# EAGLE design mini-keyboard (EAGLE 7.7.0)
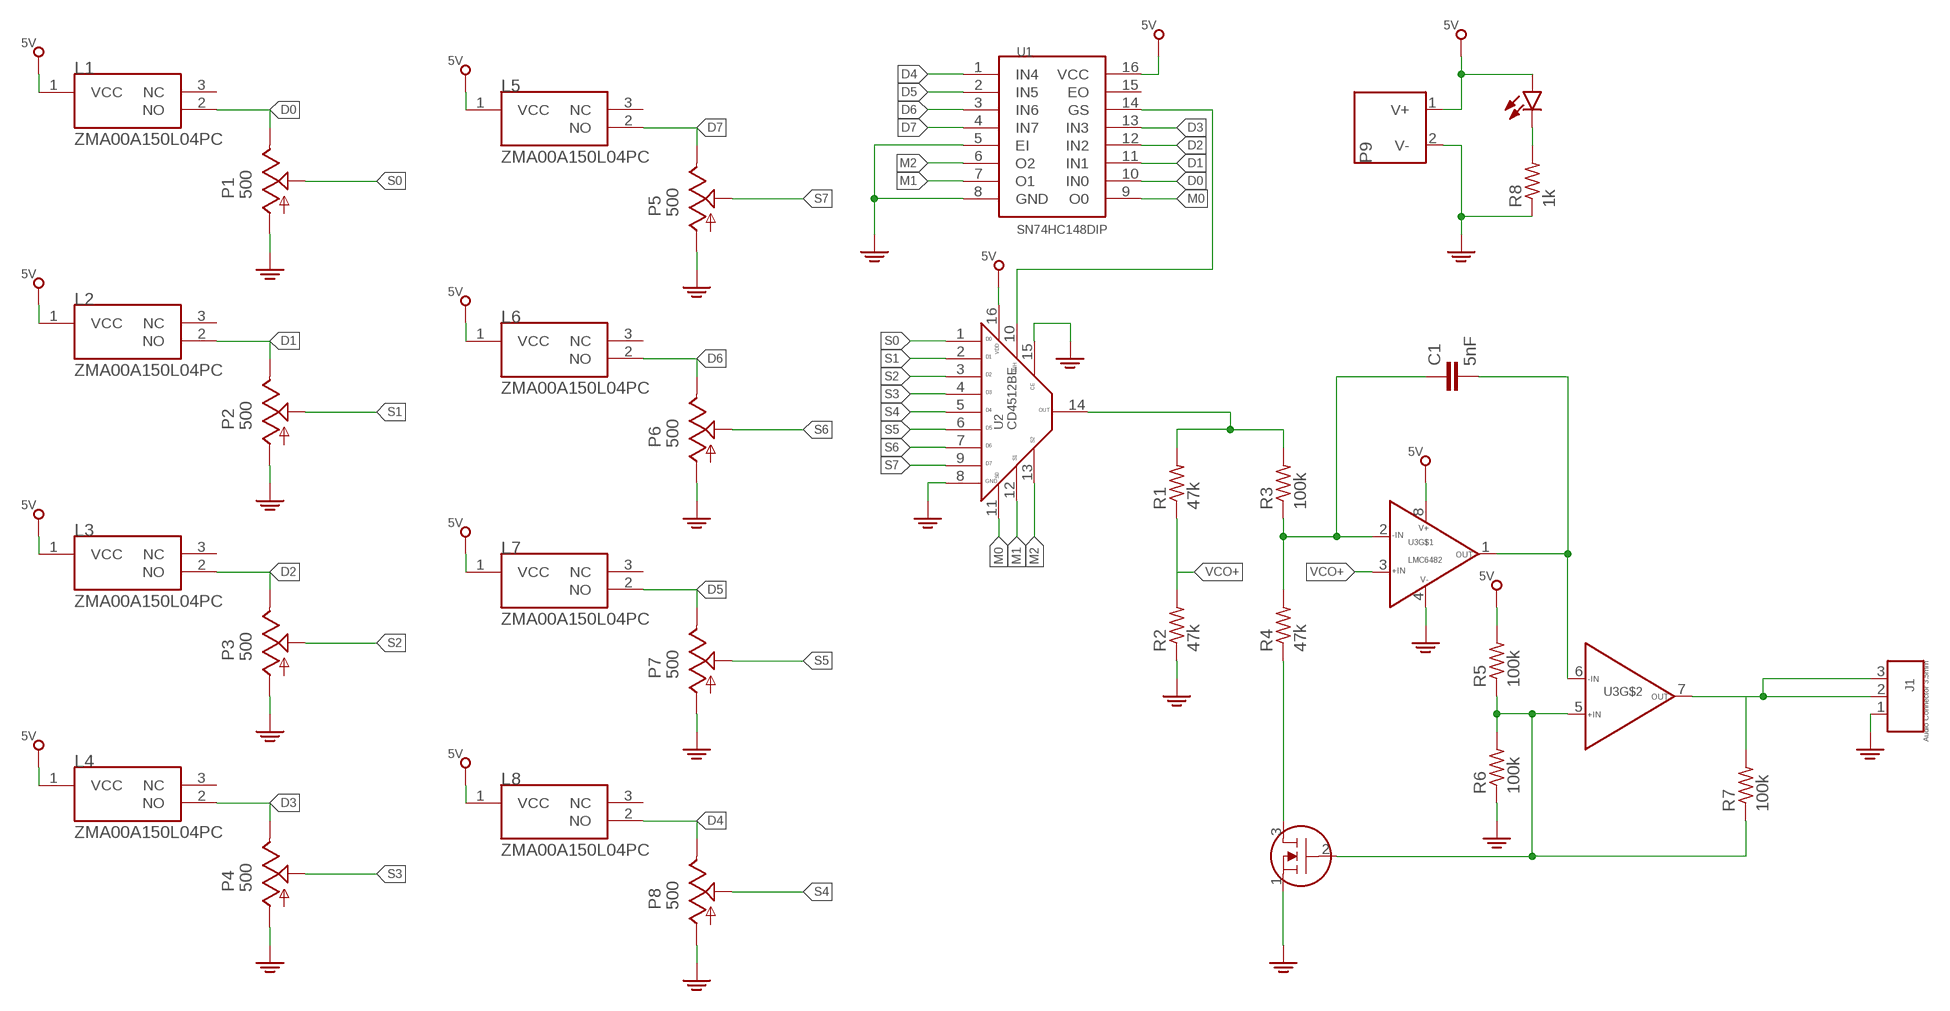
[diagram p0: schematic, sheet 1]

## Parts
C1  5nF  C0603  [0603]
J1  SJ-3523-SMT  [SJ-352X-SMT]
L1  ZMA00A150L04PC  [ZMA-LIMSWITCH]
L2  ZMA00A150L04PC  [ZMA-LIMSWITCH]
L3  ZMA00A150L04PC  [ZMA-LIMSWITCH]
L4  ZMA00A150L04PC  [ZMA-LIMSWITCH]
L5  ZMA00A150L04PC  [ZMA-LIMSWITCH]
L6  ZMA00A150L04PC  [ZMA-LIMSWITCH]
L7  ZMA00A150L04PC  [ZMA-LIMSWITCH]
L8  ZMA00A150L04PC  [ZMA-LIMSWITCH]
P1  500  POTSMD  [3214X]
P2  500  POTSMD  [3214X]
P3  500  POTSMD  [3214X]
P4  500  POTSMD  [3214X]
P5  500  POTSMD  [3214X]
P6  500  POTSMD  [3214X]
P7  500  POTSMD  [3214X]
P8  500  POTSMD  [3214X]
P9  SINGLE-LINE  [BARREL-SPFUN-BRBRD]
PWR  LED-STD  [0603]
R1  47k  R0603  [0603]
R2  47k  R0603  [0603]
R3  100k  R0603  [0603]
R4  47k  R0603  [0603]
R5  100k  R0603  [0603]
R6  100k  R0603  [0603]
R7  100k  R0603  [0603]
R8  1k  R0603  [0603]
U1  SN74HC148DIP  [PDIP-16]
U2  CD4512BE  [PDIP-16]
U3  LMC6482  [DIL08]
U23  2N7000-G  [TO92-CBE]

## Nets
5V: L1.1(VCC) L2.1(VCC) L3.1(VCC) L4.1(VCC) L5.1(VCC) L6.1(VCC) L7.1(VCC) L8.1(VCC) P9.1(V+) PWR.IN R5.2 U1.16(VCC) U2.16(VDD) U3.8(VCC)
D0: L1.2(NO) P1.3(E) U1.10(IN0)
D1: L2.2(NO) P2.3(E) U1.11(IN1)
D2: L3.2(NO) P3.3(E) U1.12(IN2)
D3: L4.2(NO) P4.3(E) U1.13(IN3)
D4: L8.2(NO) P8.3(E) U1.1(IN4)
D5: L7.2(NO) P7.3(E) U1.2(IN5)
D6: L6.2(NO) P6.3(E) U1.3(IN6)
D7: L5.2(NO) P5.3(E) U1.4(IN7)
GND: J1.1 P1.1(A) P2.1(A) P3.1(A) P4.1(A) P5.1(A) P6.1(A) P7.1(A) P8.1(A) P9.2(V-) R2.1 R6.1 R8.1 U1.5(EI) U1.8(GND) U2.8(GND) U2.15(DISABLE) U3.4(GND) U23.1(S)
M0: U1.9(O0) U2.11(S0)
M1: U1.7(O1) U2.12(S1)
M2: U1.6(O2) U2.13(S2)
N$1: R4.1 U23.3(D)
N$2: R1.2 R3.2 U2.14(OUT)
N$3: U1.14(GS) U2.10(INHIBIT)
N$4: C1.1 R3.1 R4.2 U3.2(-INA)
N$5: J1.2 J1.3 R7.2 U3.7(OUTB)
N$6: R5.1 R6.2 R7.1 U3.5(+INB) U23.2(G)
N$7: PWR.OUT R8.2
N$8: C1.2 U3.1(OUTA) U3.6(-INB)
S0: P1.2(S) U2.1(D0)
S1: P2.2(S) U2.2(D1)
S2: P3.2(S) U2.3(D2)
S3: P4.2(S) U2.4(D3)
S4: P8.2(S) U2.5(D4)
S5: P7.2(S) U2.6(D5)
S6: P6.2(S) U2.7(D6)
S7: P5.2(S) U2.9(D7)
VCO+: R1.1 R2.2 U3.3(+INA)
Unconnected: L1.3(NC) L2.3(NC) L3.3(NC) L4.3(NC) L5.3(NC) L6.3(NC) L7.3(NC) L8.3(NC) U1.15(EO)

## Library data of the parts
C1 = RCL:C
J1 = audio-connectors:SJ-3523-SMT
L1-L8 = switches:ZMA00A150L04PC
P1-P8 = Pots:POT
P9 = PWR-Connectors:SINGLE-LINE: 4UCON Part Num: 18742
PWR = LED:LED-STD
R1-R8 = RCL:R
U1 = logic:SN74HC148
U2 = logic:CD4512
U3 = Opamps:LMC6482
U23 = Transistors:2N7000

## Board
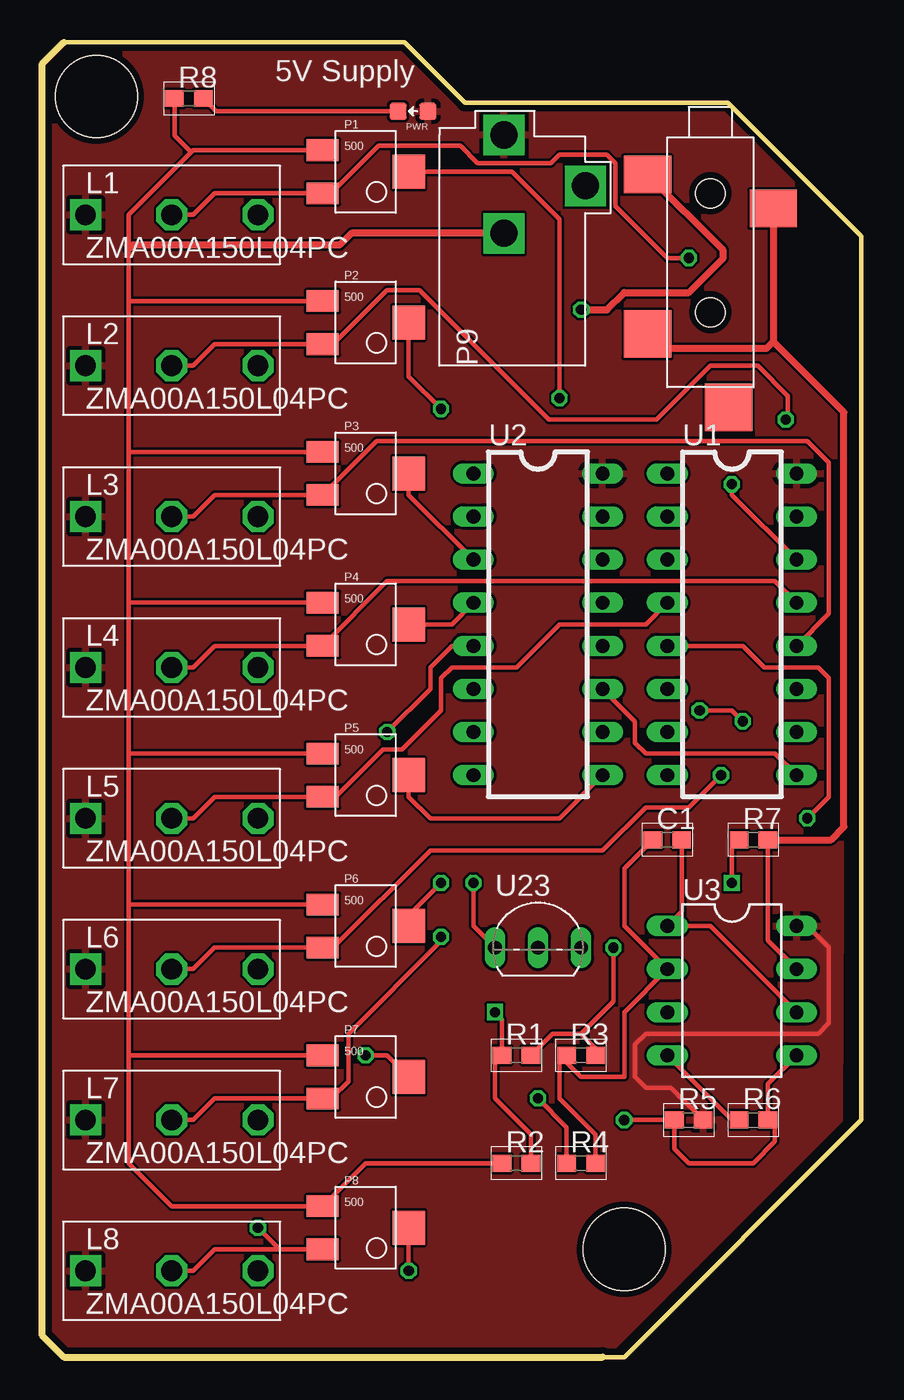
[diagram p1: board, top side]
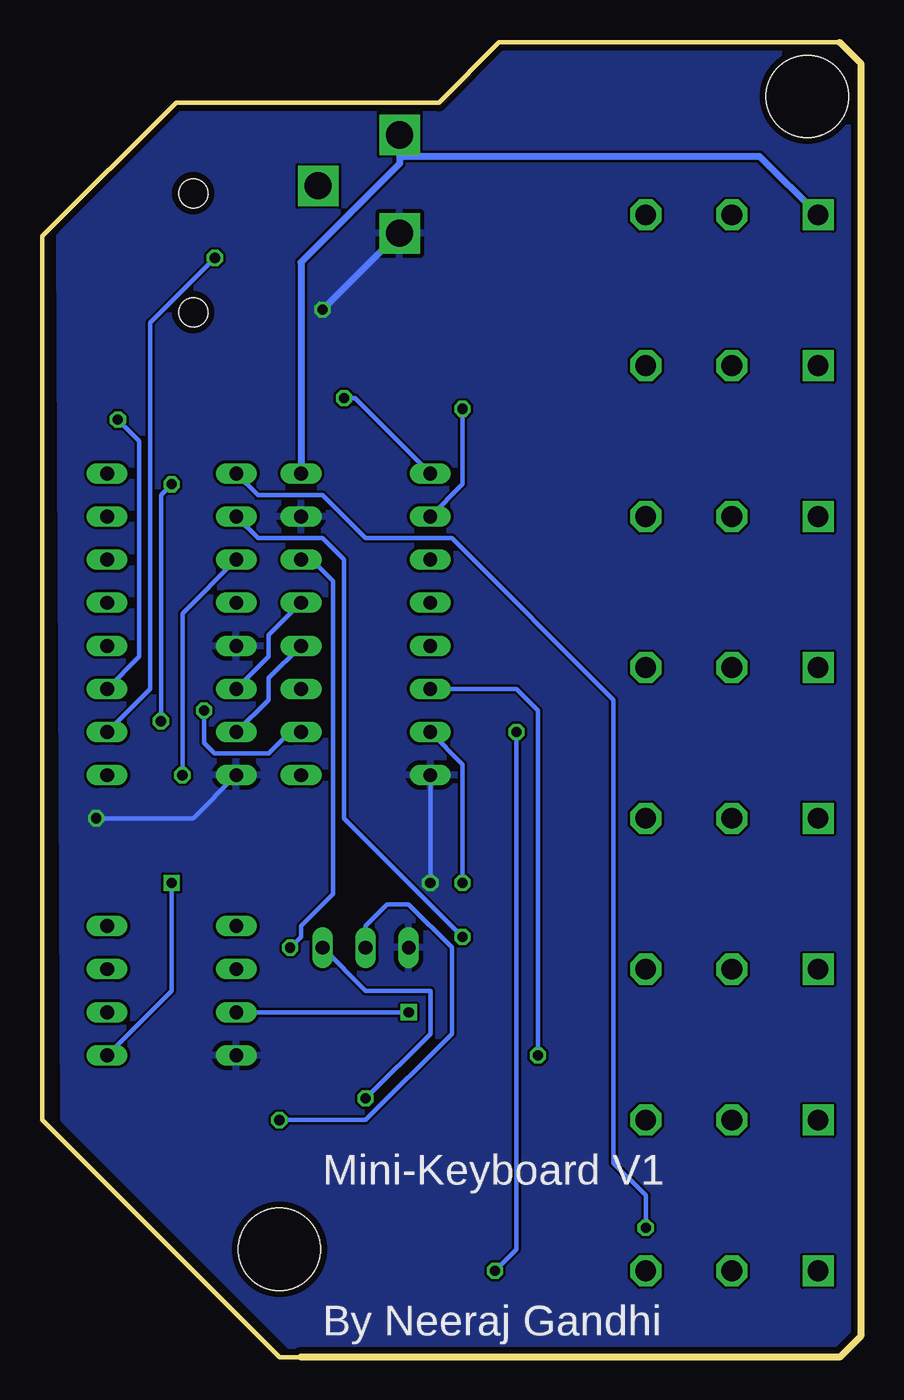
[diagram p2: board, bottom side, seen from below]

Size 48.26 x 77.47 mm. Coordinates in mm from the lower left corner, seen from the top.
Outline: 1.27,0 33.02,0 34.29,0 48.26,13.97 48.26,66.04 40.39,73.91 24.89,73.91 21.34,77.47 1.27,77.47 0,76.2 0,1.27 1.27,0
Copper layers (1*16): Top 0.0356mm / dielectric 1.5011mm / Bottom 0.0356mm
Design rules "OshparkDRU": minimum track width 6mil, minimum drill 13mil, track to track 6mil, track to pad 6mil, pad to pad 6mil, via to via 6mil, smd to smd 6mil, copper to edge 15mil, drill to drill 6mil, minimum pad ring 7mil, minimum via ring 7mil, stop-mask expansion 3mil, vias tented up to drill 0mil, thermal gap 10mil
Holes 4.83 mm at 3.17,74.3 34.29,6.35

### Footprints (pad centres in the part's own frame; a part is rotated, then mirrored left to right if it is on the bottom)
0603 = smd 1.1 x 1: 1 -0.85,0; 2 0.85,0
SJ-352X-SMT = smd 2.21 x 2.794: 1 -1.105,-3.708; 3 0.902,3.708 | smd 2.794 x 2.794: 2 8.293,-3.708; 4 12.611,1.079 | hole 1.702: 0,0; 7.01,0
ZMA-LIMSWITCH = drill 1.219 square: 1 -5.08,0 | drill 1.219 octagon: 2 0,0; 3 5.08,0
3214X = smd 1.905 x 1.27: 1 -2.54,1.27; 3 -2.54,-1.27 | smd 1.905 x 2.007: 2 2.54,0
BARREL-SPFUN-BRBRD = drill 1.6 square: 1 13.6,4.8; 2 7.8,4.8; 3 10.6,0
0603' = smd 1 x 1: IN 0,-0.877; OUT 0,0.877
PDIP-16 = drill 0.813 long: 1 -3.81,8.89; 2 -3.81,6.35; 3 -3.81,3.81; 4 -3.81,1.27; 5 -3.81,-1.27; 6 -3.81,-3.81; 7 -3.81,-6.35; 8 -3.81,-8.89; 9 3.81,-8.89; 10 3.81,-6.35; 11 3.81,-3.81; 12 3.81,-1.27; 13 3.81,1.27; 14 3.81,3.81; 15 3.81,6.35; 16 3.81,8.89
DIL08 = drill 0.813 long: 1 -3.81,3.81; 2 -3.81,1.27; 3 -3.81,-1.27; 4 -3.81,-3.81; 5 3.81,-3.81; 6 3.81,-1.27; 7 3.81,1.27; 8 3.81,3.81
TO92-CBE = drill 0.813 long: 1 -2.54,0; 2 0,0; 3 2.54,0

### Placement (x,y rotation side)
C1  36.83,30.48 0 top
J1  39.37,68.58 270 top
L1  7.62,67.31 0 top
L2  7.62,58.42 0 top
L3  7.62,49.53 0 top
L4  7.62,40.64 0 top
L5  7.62,31.75 0 top
L6  7.62,22.86 0 top
L7  7.62,13.97 0 top
L8  7.62,5.08 0 top
P1  19.05,69.85 0 top
P2  19.05,60.96 0 top
P3  19.05,52.07 0 top
P4  19.05,43.18 0 top
P5  19.05,34.29 0 top
P6  19.05,25.4 0 top
P7  19.05,16.51 0 top
P8  19.05,7.62 0 top
P9  32,58.42 90 top
PWR  LED-STD  [0603']  21.84,73.41 90 top
R1  27.94,17.78 0 top
R2  27.94,11.43 0 top
R3  31.75,17.78 0 top
R4  31.75,11.43 0 top
R5  38.1,13.97 0 top
R6  41.91,13.97 0 top
R7  41.91,30.48 0 top
R8  8.64,74.17 0 top
U1  40.64,43.18 0 top
U2  29.21,43.18 0 top
U3  40.64,21.59 0 top
U23  29.21,24.13 0 top

### Tracks (layer width: path | path; a pad name or v marks a point on that pad's centre or on a via)
5V
  Top 0.254: U3.8 45.09,25.4 46.35,24.13 46.35,19.68 45.72,19.05 35.56,19.05 34.92,18.41 34.92,16.51 35.56,15.88 37.05,15.88 R5.2
  Bottom 0.406: U2.16 33.02,64.52 27.2,70.33 27.2,70.87 | L1.1 5.98,70.75 27.09,70.75 27.2,70.87 | P9.1 27.2,70.87
  pour Top: 0,76.2 0,1.27 1.27,0 33.02,0 46.99,13.97 47.24,66.04 36.83,77.47 1.27,77.47
D0  (via drill 0.6)
  Top 0.254: L1.2 8.89,67.31 10.16,68.58 P1.3 17.02,68.58 19.81,71.37 24.64,71.37 25.65,70.36 29.97,70.36 30.48,70.87 33.27,70.87 33.78,70.36 33.78,67.82 36.83,64.77 v38.1,64.77
  Bottom 0.254: v38.1,64.77 41.91,60.96 41.91,39.37 U1.10
D1  (via drill 0.6)
  Top 0.254: L2.2 8.89,58.42 10.16,59.69 P2.3 17.14,59.69 20.32,62.87 22.23,62.87 29.84,55.24 36.2,55.24 39.37,58.42 42.16,58.42 43.94,56.64 43.94,55.37 v43.81,55.24
  Bottom 0.254: v43.81,55.24 42.55,53.98 42.55,41.27 U1.11
D2
  Top 0.254: L3.2 8.89,49.53 10.16,50.8 P3.3 19.68,53.98 45.09,53.98 46.35,52.7 46.35,43.81 U1.12
D3
  Top 0.254: L4.2 8.89,40.64 10.16,41.91 P4.3 20.32,45.72 43.18,45.72 U1.13
D4  (via drill 0.6)
  Top 0.254: L8.2 8.89,5.08 10.16,6.35 P8.3 13.97,6.35 v12.7,7.62
  Bottom 0.254: v12.7,7.62 12.7,9.53 14.61,11.43 14.61,38.73 24.13,48.26 29.21,48.26 31.75,50.8 35.56,50.8 U1.1
D5  (via drill 0.6)
  Top 0.254: L7.2 8.89,13.97 10.16,15.24 P7.3 17.02,15.24 | 17.02,15.24 17.14,15.24 | v23.5,24.77 23.5,24.51 18.03,19.05 18.03,16.26 17.02,15.24
  Bottom 0.254: v23.5,24.77 30.48,31.75 30.48,46.99 31.75,48.26 35.56,48.26 U1.2
D6  (via drill 0.6)
  Top 0.254: L6.2 8.89,22.86 10.16,24.13 P6.3 17.14,24.13 22.86,29.84 33.02,29.84 35.56,32.38 38.1,32.38 v40.01,34.29
  Bottom 0.254: v40.01,34.29 40.01,43.81 U1.3
D7
  Top 0.254: L5.2 8.89,31.75 10.16,33.02 P5.3 17.27,33.02 20.07,35.81 21.21,35.81 23.5,38.1 23.5,40.01 24.13,40.64 27.94,40.64 30.48,43.18 35.56,43.18 U1.4
GND  (via drill 0.6)
  Top 0.254: R6.1 40.64,13.97 U3.4 | P1.1 8.89,71.12 8.76,70.99 | 8.76,70.99 5.08,67.31 5.08,65.28 5.08,62.23 | 5.08,62.23 5.08,53.34 | 5.08,53.34 5.08,44.45 | 5.08,44.45 5.08,35.56 | 5.08,35.56 5.08,26.67 | 5.08,26.67 5.08,17.78 | 5.08,17.78 5.08,11.43 7.62,8.89 P8.1 19.05,11.43 R2.1 | P7.1 5.08,17.78 | P6.1 5.08,26.67 | P5.1 5.08,35.56 | P4.1 5.08,44.45 | P3.1 5.08,53.34 | P2.1 5.08,62.23 | v25.4,27.94 25.4,25.4 U23.1 | U1.5 41.27,41.91 42.55,40.64 45.72,40.64 46.35,40.01 46.35,33.02 v45.09,31.75 | R8.1 7.79,71.97 8.76,70.99
  Top 0.406: v31.75,61.72 33.27,61.72 34.29,62.74 38.1,62.74 40.13,64.77 40.13,65.22 J1.1 | P9.2 18.21,66.22 17.53,65.53 5.33,65.53 5.08,65.28
  Bottom 0.254: U2.8 v25.4,27.94 | v45.09,31.75 39.37,31.75 U1.8
  Bottom 0.406: P9.2 27.25,66.22 v31.75,61.72
  pour Bottom: 0,76.2 0,1.27 1.27,0 33.02,0 46.99,13.97 47.24,66.04 36.83,77.47 1.27,77.47
M0
  Top 0.254: U2.11 34.92,37.47 34.92,36.2 35.56,35.56 43.18,35.56 U1.9
M1
  Bottom 0.254: U2.12 34.92,40.01 34.92,38.73 U1.7
M2
  Bottom 0.254: U2.13 34.92,42.55 34.92,41.27 U1.6
N$1  (via drill 0.6)
  Top 0.254: R4.1 30.9,13.55 v29.21,15.24
  Bottom 0.254: v29.21,15.24 25.4,19.05 25.4,21.59 29.21,21.59 U23.3
N$2  (via drill 0.6)
  Top 0.254: R3.2 32.6,18.2 31.75,19.05 | 31.75,19.05 30.06,19.05 R1.2 | v33.66,24.13 33.66,20.95 31.75,19.05
  Bottom 0.254: U2.14 32.38,46.99 31.11,45.72 31.11,27.3 33.02,25.4 33.02,24.77 v33.66,24.13
N$3  (via drill 0.6)
  Top 0.254: v38.73,38.1 40.64,38.1 v41.27,37.47 | v40.64,51.44 40.64,50.8 U1.14
  Bottom 0.254: U2.10 33.66,36.83 34.92,35.56 38.1,35.56 38.73,36.2 v38.73,38.1 | v41.27,37.47 41.27,50.8 v40.64,51.44
N$4
  Top 0.254: R4.2 32.6,13.12 30.48,15.24 30.48,17.36 R3.1 30.9,17.36 31.75,16.51 34.29,16.51 34.29,20.32 U3.2 34.29,25.4 34.29,28.79 C1.1
N$5
  Top 0.254: R7.2 42.76,24.55 U3.7
  Top 0.406: J1.3 43.08,59.84 | 43.08,59.84 42.67,59.44 36.51,59.44 J1.2 | R7.2 46.48,30.48 47.24,31.24 47.24,55.68 43.08,59.84
N$6  (via drill 0.6)
  Top 0.254: U3.5 42.76,16.09 R6.2 43.18,13.55 43.18,12.7 41.91,11.43 38.1,11.43 37.25,12.28 R5.1 v34.29,13.97 | R7.1 40.64,30.48 v40.64,27.94
  Bottom 0.254: v40.64,27.94 40.64,21.59 U3.5 | U23.2 29.21,25.4 27.94,26.67 26.67,26.67 24.13,24.13 24.13,19.05 29.21,13.97 v34.29,13.97
N$7
  Top 0.254: PWR.OUT 10.25,73.41 R8.2
N$8
  Top 0.254: U3.6 39.37,25.4 U3.1 37.68,26.25 C1.2
S0  (via drill 0.6)
  Top 0.254: v30.48,56.52 30.48,67.06 27.69,69.85 P1.2
  Bottom 0.254: v30.48,56.52 29.84,56.52 U2.1
S1  (via drill 0.6)
  Top 0.254: P2.2 21.59,57.78 v23.5,55.88
  Bottom 0.254: v23.5,55.88 23.5,51.44 U2.2
S2
  Top 0.254: P3.2 21.59,50.8 U2.3
S3
  Top 0.254: P4.2 24.13,43.18 U2.4
S4  (via drill 0.6)
  Top 0.254: U2.5 24.13,41.91 22.86,40.64 22.86,39.37 v20.32,36.83 | v21.59,5.08 P8.2
  Bottom 0.254: v20.32,36.83 20.32,6.35 v21.59,5.08
S5  (via drill 0.6)
  Top 0.254: v19.05,17.78 20.32,17.78 P7.2
  Bottom 0.254: U2.6 20.32,39.37 19.05,38.1 v19.05,17.78
S6  (via drill 0.6)
  Top 0.254: P6.2 21.59,26.04 v23.5,27.94
  Bottom 0.254: v23.5,27.94 23.5,34.92 U2.7
S7
  Top 0.254: P5.2 21.59,33.02 22.86,31.75 30.48,31.75 U2.9
VCO+  (via drill 0.6)
  Top 0.254: R2.2 28.79,13.12 26.67,15.24 26.67,17.36 R1.1 27.09,19.9 v26.67,20.32
  Bottom 0.254: v26.67,20.32 U3.3

### Text on the board
tPlace: 5V Supply
bPlace: Mini-Keyboard V1 | By Neeraj Gandhi